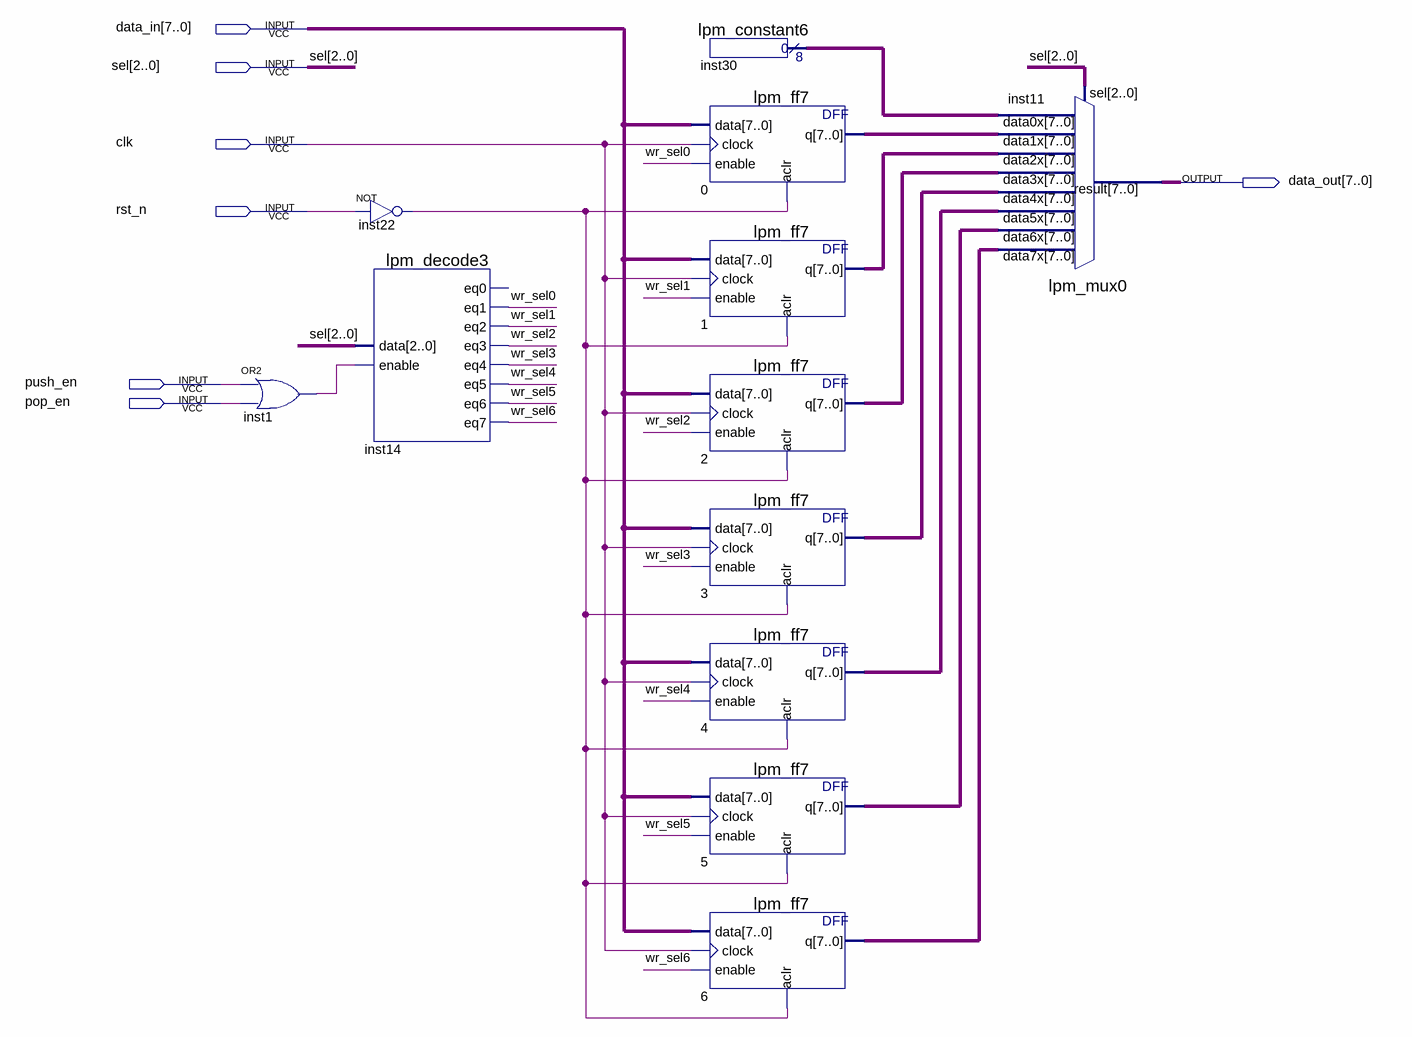
[diagram p0: schematic sheet]
// Quartus schematic stack_memory.bdf as structural Verilog: 12 symbols, 7 pins
module stack_memory (
  input  [7:0] data_in,
  input  [2:0] sel,
  input  clk,
  input  rst_n,
  input  push_en,
  input  pop_en,
  output [7:0] data_out
);

  wire inst1_out, inst22_out, wr_sel0, wr_sel1, wr_sel2, wr_sel3, wr_sel4, wr_sel5, wr_sel6;
  wire [7:0] inst30_result, n0_q, n1_q, n2_q, n3_q, n4_q, n5_q, n6_q;

  or inst1 (inst1_out, push_en, pop_en);
  not inst22 (inst22_out, rst_n);
  lpm_decode3 inst14 (
    .data(sel), .enable(inst1_out), .eq1(wr_sel0), .eq2(wr_sel1), .eq3(wr_sel2), .eq4(wr_sel3),
    .eq5(wr_sel4), .eq6(wr_sel5), .eq7(wr_sel6));  // open: eq0
  lpm_constant6 inst30 (.result(inst30_result));
  lpm_ff7 u_0 (.data(data_in), .clock(clk), .enable(wr_sel0), .aclr(inst22_out), .q(n0_q));
  lpm_ff7 u_1 (.data(data_in), .clock(clk), .enable(wr_sel1), .aclr(inst22_out), .q(n1_q));
  lpm_ff7 u_2 (.data(data_in), .clock(clk), .enable(wr_sel2), .aclr(inst22_out), .q(n2_q));
  lpm_ff7 u_3 (.data(data_in), .clock(clk), .enable(wr_sel3), .aclr(inst22_out), .q(n3_q));
  lpm_ff7 u_4 (.data(data_in), .clock(clk), .enable(wr_sel4), .aclr(inst22_out), .q(n4_q));
  lpm_ff7 u_5 (.data(data_in), .clock(clk), .enable(wr_sel5), .aclr(inst22_out), .q(n5_q));
  lpm_ff7 u_6 (.data(data_in), .clock(clk), .enable(wr_sel6), .aclr(inst22_out), .q(n6_q));
  lpm_mux0 inst11 (
    .data7x(n6_q), .data6x(n5_q), .data5x(n4_q), .data4x(n3_q), .data3x(n2_q), .data2x(n1_q), .data1x(n0_q),
    .data0x(inst30_result), .sel(sel), .result(data_out));
endmodule
